# Altium schematic sheet IDCI_WifiNode_CPU1.SchDoc
size A4
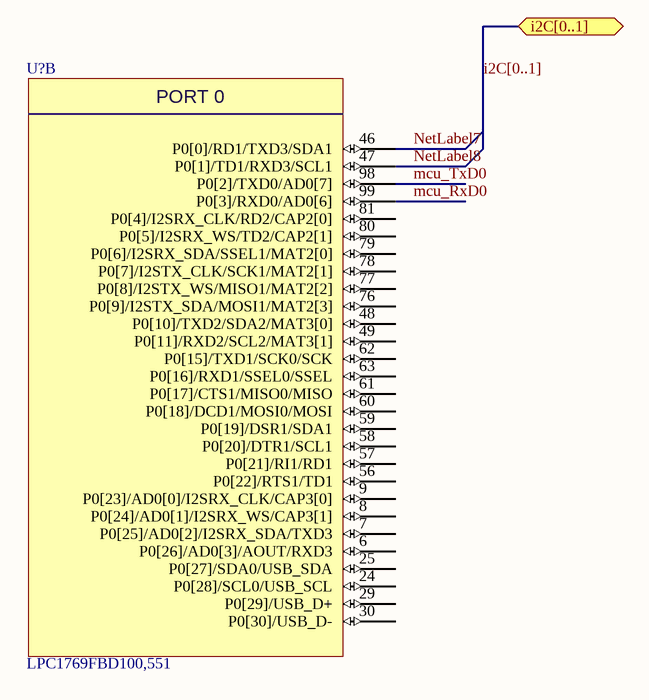
[diagram p0: IDCI_WifiNode_CPU1.SchDoc]

## Parts
U?  LPC1769FBD100,551  (part B of 4)

## Ports
i2C[0..1] (bidir)

## Nets
mcu_RxD0: U?.99(P0[3]/RXD0/AD0[6])
mcu_TxD0: U?.98(P0[2]/TXD0/AD0[7])
NetLabel7: U?.46(P0[0]/RD1/TXD3/SDA1)
NetLabel8: U?.47(P0[1]/TD1/RXD3/SCL1)

Not connected (* = marked no-connect by the designer): U? 6(P0[26]/AD0[3]/AOUT/RXD3) 7(P0[25]/AD0[2]/I2SRX_SDA/TXD3) 8(P0[24]/AD0[1]/I2SRX_WS/CAP3[1]) 9(P0[23]/AD0[0]/I2SRX_CLK/CAP3[0]) 24(P0[28]/SCL0/USB_SCL) 25(P0[27]/SDA0/USB_SDA) 29(P0[29]/USB_D+) 30(P0[30]/USB_D-) 48(P0[10]/TXD2/SDA2/MAT3[0]) 49(P0[11]/RXD2/SCL2/MAT3[1]) 56(P0[22]/RTS1/TD1) 57(P0[21]/RI1/RD1) 58(P0[20]/DTR1/SCL1) 59(P0[19]/DSR1/SDA1) 60(P0[18]/DCD1/MOSI0/MOSI) 61(P0[17]/CTS1/MISO0/MISO) 62(P0[15]/TXD1/SCK0/SCK) 63(P0[16]/RXD1/SSEL0/SSEL) 76(P0[9]/I2STX_SDA/MOSI1/MAT2[3]) 77(P0[8]/I2STX_WS/MISO1/MAT2[2]) 78(P0[7]/I2STX_CLK/SCK1/MAT2[1]) 79(P0[6]/I2SRX_SDA/SSEL1/MAT2[0]) 80(P0[5]/I2SRX_WS/TD2/CAP2[1]) 81(P0[4]/I2SRX_CLK/RD2/CAP2[0])

## Buses and harness runs
bus i2C[0..1] = port i2C[0..1]

## Notes on the sheet
- Title:
- Size:
- Author:
- A4
- Sheet
- of
- Revision:
- File:
- Date:
- (in symbol LPC1769FBD100_Multipart, part B) PORT 0

## Library data of the parts
U? = LPC1769FBD100_Multipart: Mcu Cortex M3 LQFP100